# Altium schematic sheet MCU.SchDoc
size A4; SheetNumber: 1; SheetTotal: 3
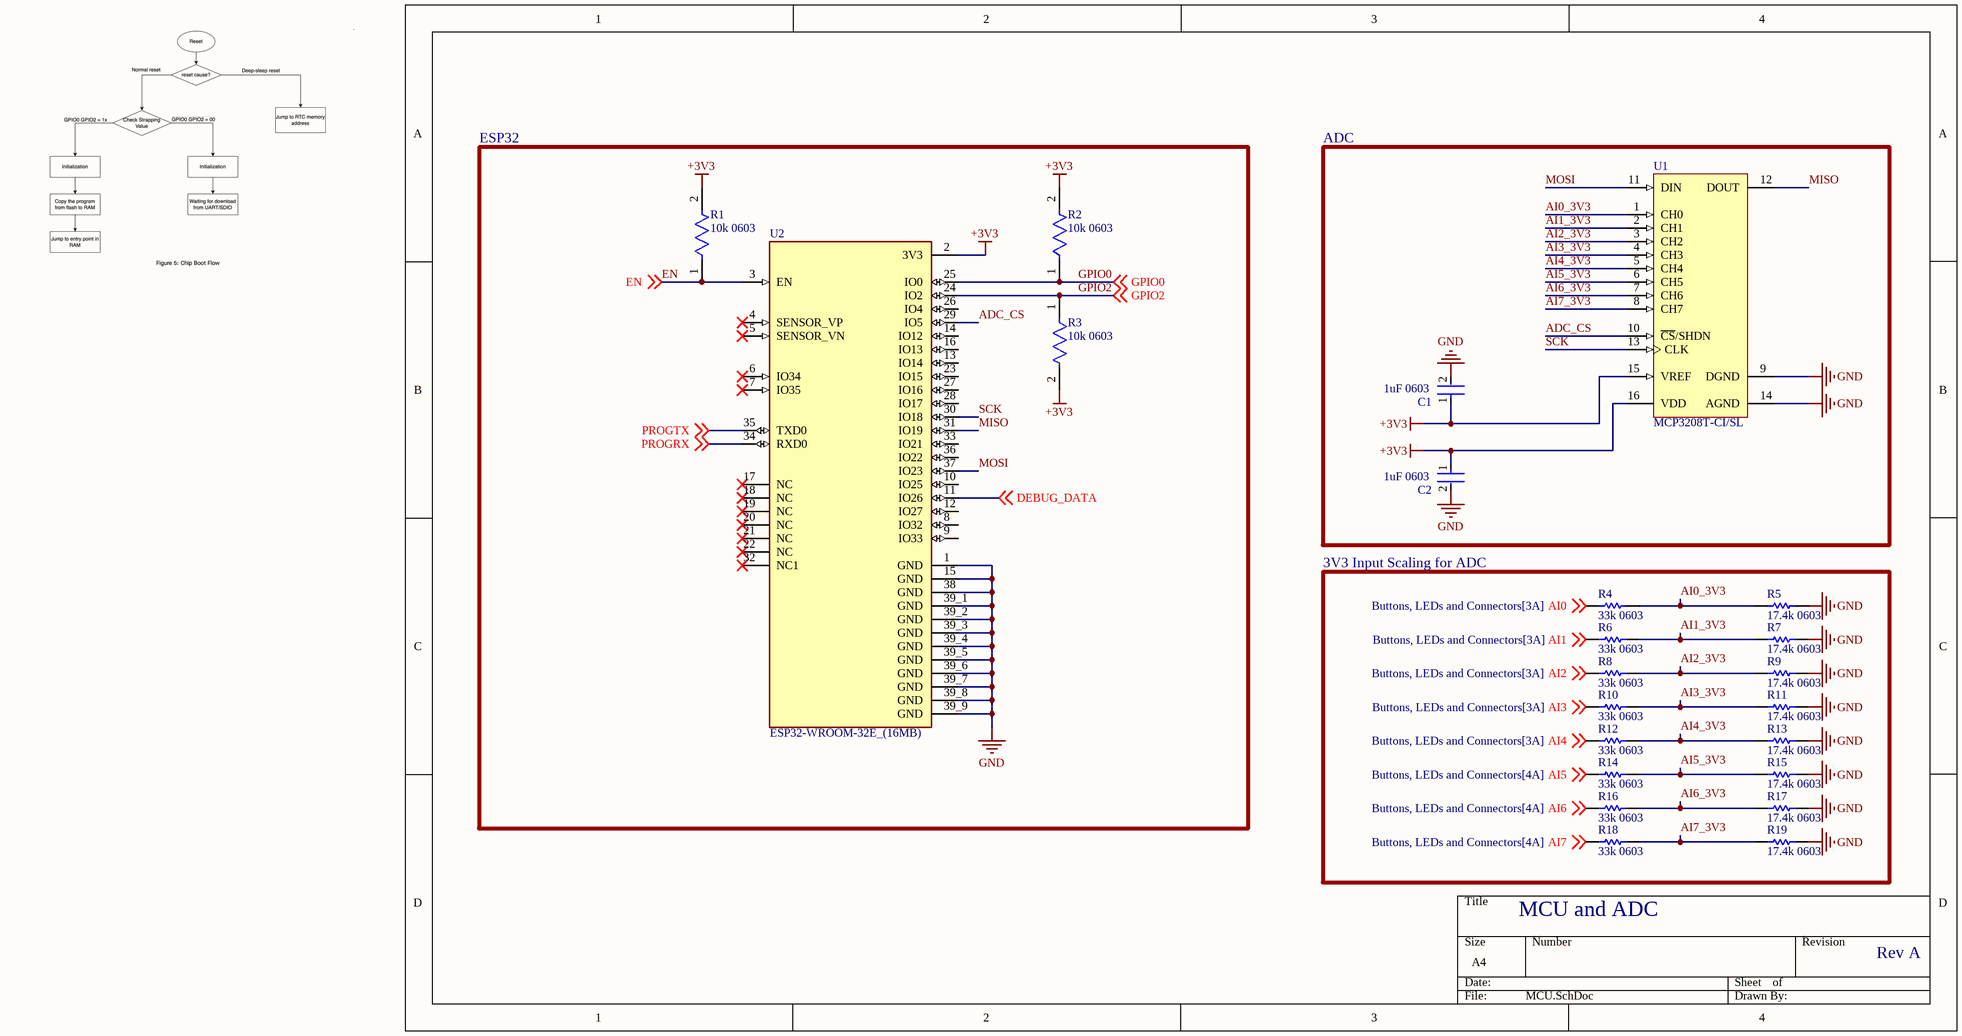
[diagram p0: MCU.SchDoc]

## Parts
C1  1uF 0603  [FP-CC0603-DA-MFG]
C2  1uF 0603  [FP-CC0603-DA-MFG]
R1  10k 0603  [FP-RC0603-0_55-IPC_C]
R2  10k 0603  [FP-RC0603-0_55-IPC_C]
R3  10k 0603  [FP-RC0603-0_55-IPC_C]
R4  33k 0603  [RESC1608X55X25LL10T15]
R5  17.4k 0603  [RESC1608X55X25NL10T15]
R6  33k 0603  [RESC1608X55X25LL10T15]
R7  17.4k 0603  [RESC1608X55X25NL10T15]
R8  33k 0603  [RESC1608X55X25LL10T15]
R9  17.4k 0603  [RESC1608X55X25NL10T15]
R10  33k 0603  [RESC1608X55X25LL10T15]
R11  17.4k 0603  [RESC1608X55X25NL10T15]
R12  33k 0603  [RESC1608X55X25LL10T15]
R13  17.4k 0603  [RESC1608X55X25NL10T15]
R14  33k 0603  [RESC1608X55X25LL10T15]
R15  17.4k 0603  [RESC1608X55X25NL10T15]
R16  33k 0603  [RESC1608X55X25LL10T15]
R17  17.4k 0603  [RESC1608X55X25NL10T15]
R18  33k 0603  [RESC1608X55X25LL10T15]
R19  17.4k 0603  [RESC1608X55X25NL10T15]
U1  MCP3208T-CI/SL  [SOIC-SL16_L]
U2  ESP32-WROOM-32E_(16MB)  [XCVR_ESP32-WROOM-32E_(16MB)]

## Blocks framed on the sheet
ESP32: R1-R3 U2
ADC: C1 C2 U1
3V3 Input Scaling for ADC: R4-R19

## Nets
+3V3: C1.1 C2.1 R1.2 R2.2 R3.2 U1.15(VREF) U1.16(VDD) U2.2(3V3)
GND: C1.2 C2.2 R5.1 R7.1 R9.1 R11.1 R13.1 R15.1 R17.1 R19.1 U1.9(DGND) U1.14(AGND) U2.1(GND) U2.15(GND) U2.38(GND) U2.39_1(GND) U2.39_2(GND) U2.39_3(GND) U2.39_4(GND) U2.39_5(GND) U2.39_6(GND) U2.39_7(GND) U2.39_8(GND) U2.39_9(GND)
ADC_CS: U1.10(~{CS}/SHDN) U2.29(IO5)
AI0: R4.1 ; off-sheet AI0
AI0_3V3: R4.2 R5.2 U1.1(CH0)
AI1: R6.1 ; off-sheet AI1
AI1_3V3: R6.2 R7.2 U1.2(CH1)
AI2: R8.1 ; off-sheet AI2
AI2_3V3: R8.2 R9.2 U1.3(CH2)
AI3: R10.1 ; off-sheet AI3
AI3_3V3: R10.2 R11.2 U1.4(CH3)
AI4: R12.1 ; off-sheet AI4
AI4_3V3: R12.2 R13.2 U1.5(CH4)
AI5: R14.1 ; off-sheet AI5
AI5_3V3: R14.2 R15.2 U1.6(CH5)
AI6: R16.1 ; off-sheet AI6
AI6_3V3: R16.2 R17.2 U1.7(CH6)
AI7: R18.1 ; off-sheet AI7
AI7_3V3: R18.2 R19.2 U1.8(CH7)
DEBUG_DATA: U2.11(IO26) ; off-sheet DEBUG_DATA
EN: R1.1 U2.3(EN) ; off-sheet EN
GPIO0: R2.1 U2.25(IO0) ; off-sheet GPIO0
GPIO2: R3.1 U2.24(IO2) ; off-sheet GPIO2
MISO: U1.12(DOUT) U2.31(IO19)
MOSI: U1.11(DIN) U2.37(IO23)
PROGRX: U2.34(RXD0) ; off-sheet PROGRX
PROGTX: U2.35(TXD0) ; off-sheet PROGTX
SCK: U1.13(CLK) U2.30(IO18)

Not connected (* = marked no-connect by the designer): U2 4(SENSOR_VP)* 5(SENSOR_VN)* 6(IO34)* 7(IO35)* 8(IO32) 9(IO33) 10(IO25) 12(IO27) 13(IO14) 14(IO12) 16(IO13) 17(NC)* 18(NC)* 19(NC)* 20(NC)* 21(NC)* 22(NC)* 23(IO15) 26(IO4) 27(IO16) 28(IO17) 32(NC1)* 33(IO21) 36(IO22)

## Notes on the sheet
- MCU and ADC
- Rev A

## Library data of the parts
C1 C2 = CMP-03422-000612-1: CAP CER 1UF 25V X5R 0603; Manufacturer: YAGEO; Manufacturer Part Number: CC0603KRX5R8BB105; Material: Ceramic; Tolerance: 0.1; Temperature Coefficient: 15%; Automotive: No; Octopart: https://octopart.com/cc0603krx5r8bb105-yageo-9292811; Package: CC0603-DA; Temperature Range High: +125°C; Digikey Description: CAP CER 1UF 25V X5R 0603; Mouser Description: Multilayer Ceramic Capacitors MLCC - SMD/SMT 1.0uF 25V X5R 10%; Device Class L2: Capacitors; Category: Cap; Value: 1 uF; Temperature: -55°C to +125°C; ComponentLink2URL: http://www.yageo.com/documents/recent/UPY-GPHC_X7R_6.3V-to-50V_18.pdf; Capacitance: 1 uF; ComponentLink2Description: Datasheet; Voltage: 25 V; Height: 0.9mm; Device Class L3: Ceramic Capacitors; Temperature Characteristic: X5R; Footprint Url: http://www.yageo.com/exep/pages/download/literatures/UPY-C_GEN_24.pdf; Temperature Range Low: -55°C; Device Class L1: Passive Components; Voltage Rating: 25 V; Lead Free: Yes; RoHS: TRUE
R1-R3 = CMP-2100-03664-2: RES 10K OHM 1% 1/10W 0603; Voltage Rating: 75V; Voltage Rating (DC): 50V; Resistance: 10kR; Power Rating: 100mW; Temperature Coefficient: 100ppm/°C; Depth: 0.8mm; Termination: SMD/SMT; Resistor Type: Thick Film; Series: RC; Construction: Rectangular; Features: Moisture Resistant; Packaging: Tape and Reel; Min Operating Temperature: -55°C; Number of Terminations: 2; Lead Pitch: 0.3mm; RoHS Compliant: Yes; Case/Package: 0603; Resistance Tolerance: 1%; Military Standard: Not; Weight: 7.1E-05oz; Number of Pins: 2; Tolerance: 1%; Length: 1.6mm; Case Code (Imperial): 0603; Lead Free: Lead Free; Width: 0.8mm; Max Power Dissipation: 100mW; Height: 0.45mm; Max Operating Temperature: 155°C; Case Code (Metric): 1608; Size Code: 0603
R4 R6 R8 R10 R12 R14 R16 R18 = CMP-2000-06939-1: Chip Resistor, 33 Ohm, +/- 1%, 0.1 W, -55 to 155 degC, 0603 (1608 Metric), RoHS, Tape and Reel; Temperature Coefficient: 100PPM/C; Voltage Rating: 75V; Unit Weight: 0.000071oz; Power Rating: 100mW; Brand: Yageo; Resistance: 33Ohms; Product Category: ThickFilmResistors; Packaging: Reel; Tolerance: 1%; RoHS: True; Height: 0.45mm; Case Code - mm: 1608; Series: RC; Datasheet URL: http://www.yageo.com/documents/recent/PYu-RC_Group_51_RoHS_L_7.pdf; Operating Temperature Range: -55Cto+155C; Type: GeneralPurposeChipResistorSurfaceMount; Product: ThickFilmResistorsGeneralPurpose; Package / Case: 0603(1608metric); Width: 0.8mm; Length: 1.6mm; Case Code - in: 0603; Mounting Technology: SurfaceMount; Manufacturer URL: http://www.yageo.com/; Manufacturer: Yageo; Package Reference: 0603; Termination Style: SMD/SMT; Datasheet Version: Rev. 7, 05/2017; Package Description: 2-Pin Surface Mount Device, Body 1.6 x 0.8 mm
R5 R7 R9 R11 R13 R15 R17 R19 = CMP-2000-03920-1: Part Number: RC0603FR-0717K4L; Manufacturer: Yageo
U1 = CMP-0188-00450-2: 2.7V 4-Channel/8-Channel 12-Bit A/D Converters with SPI Serial Interface, 16-Pin SOIC 150mil, C Performance Grade, Industrial Temperature, Tape and Reel; PackageDescription: 16-Lead Plastic Small Outline (SL) - Narrow, 3.90mm Body [SOIC]; ComponentLink3Description: Package Specification; PackageReference: SOIC-SL16; ComponentLink1Description: Manufacturer URL; ComponentLink2URL: http://ww1.microchip.com/downloads/en/DeviceDoc/21298e.pdf; ComponentLink1URL: http://www.microchip.com/; Code_JEDEC: MS-012-AC; ComponentLink3URL: http://www.microchip.com/stellent/groups/techpub_sg/documents/packagingspec/en012702.pdf; Code_IPC: SOIC127P600-16; ComponentLink2Description: Datasheet; RevisionNote: URLs added.; PackageVersion: revBB, Aug-2009; DatasheetVersion: revE, Sep-2008
U2 = ESP32-WROOM-32E_(16MB): MF: {'manufacturer': u'Espressif Systems'}; Package: None; Price: None; Value: *; MP: ESP32-WROOM-32E_(16MB); Availability: Unavailable